# Altium schematic sheet Nixie Valve Clock.SchDoc
size A3; SheetNumber: 1; SheetTotal: 9
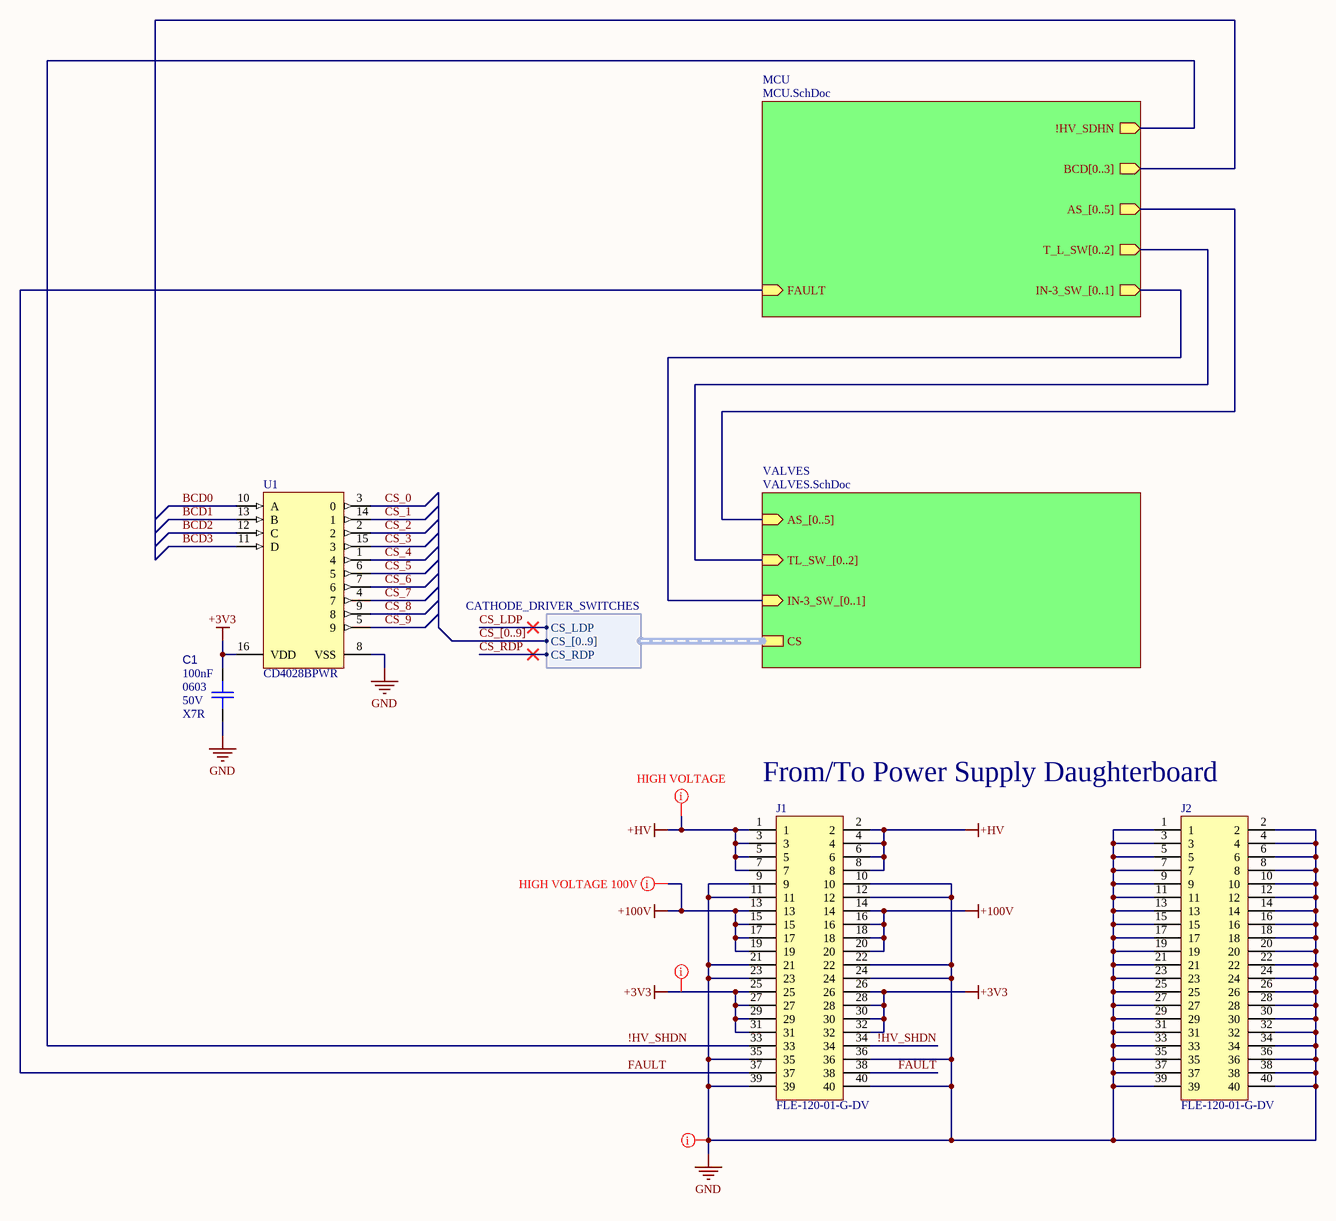
[diagram p0: Nixie Valve Clock.SchDoc]

## Parts
?  (no value)
C1  value 100nF  Voltage Rating: 50V  Case/Package: 0603  Dielectric: X7R  [CAPC1608X09N]  (hidden comment: CGA3E2X7R1H104K080AA)
J1  FLE-120-01-G-DV  [FLE-120-01-XX-DV]
J2  FLE-120-01-G-DV  [FLE-120-01-XX-DV]
U1  CD4028BPWR  [PW0016A_N]

## Sub-sheets
MCU = MCU.SchDoc: AS_[0..5] (out), BCD[0..3] (out), T_L_SW[0..2] (out), IN-3_SW_[0..1] (out), !HV_SDHN (out), FAULT (in)
VALVES = VALVES.SchDoc: AS_[0..5] (in), CS (harness CATHODE_DRIVER_SWITCHES), TL_SW_[0..2] (in), IN-3_SW_[0..1] (in)

## Harnesses
CATHODE_DRIVER_SWITCHES: CS_LDP, CS_[0..9], CS_RDP

## Nets
+3V3: C1.1 J1.25 J1.26 J1.27 J1.28 J1.29 J1.30 J1.31 J1.32 U1.16(VDD)
+100V: J1.13 J1.14 J1.15 J1.16 J1.17 J1.18 J1.19 J1.20
+HV: J1.1 J1.2 J1.3 J1.4 J1.5 J1.6 J1.7 J1.8
GND: C1.2 J1.9 J1.10 J1.11 J1.12 J1.21 J1.22 J1.23 J1.24 J1.35 J1.36 J1.39 J1.40 J2.1 J2.2 J2.3 J2.4 J2.5 J2.6 J2.7 J2.8 J2.9 J2.10 J2.11 J2.12 J2.13 J2.14 J2.15 J2.16 J2.17 J2.18 J2.19 J2.20 J2.21 J2.22 J2.23 J2.24 J2.25 J2.26 J2.27 J2.28 J2.29 J2.30 J2.31 J2.32 J2.33 J2.34 J2.35 J2.36 J2.37 J2.38 J2.39 J2.40 U1.8(VSS)
!HV_SHDN: J1.33 J1.34 ; sheet MCU/!HV_SDHN
BCD0: U1.10(A)
BCD1: U1.13(B)
BCD2: U1.12(C)
BCD3: U1.11(D)
CS_0: U1.3(0)
CS_1: U1.14(1)
CS_2: U1.2
CS_3: U1.15(3)
CS_4: U1.1(4)
CS_5: U1.6(5)
CS_6: U1.7(6)
CS_7: U1.4(7)
CS_8: U1.9(8)
CS_9: U1.5(9)
CS_LDP: sheet VALVES/CS.CS_LDP
CS_RDP: sheet VALVES/CS.CS_RDP
FAULT: J1.37 J1.38 ; sheet MCU/FAULT

## Buses and harness runs
bus CS_[0..9]
bus sheet MCU/AS_[0..5] = sheet VALVES/AS_[0..5]
bus sheet MCU/IN-3_SW_[0..1] = sheet VALVES/IN-3_SW_[0..1]
bus sheet MCU/T_L_SW[0..2] = sheet VALVES/TL_SW_[0..2]

## Layout directives
net class HIGH VOLTAGE: +HV
net class HIGH VOLTAGE 100V: +100V
net class POWER: +3V3, GND

## Notes on the sheet
- From/To Power Supply Daughterboard
- Project:
- Designer:
- Sheet
- of
- Filename:

## Library data of the parts
? = CMP-00003-4: The KETS Schematic Sheet Title Block
C1 = CMP-001-00101-1: Ceramic Capacitor, Multilayer, Ceramic, 50V, 10% +Tol, 10% -Tol, X7R, 15% TC, 0.1uF, Surface Mount, 0603; Reference Standard: AEC-Q200; Multilayer: Yes; Tolerance  (fill in as +-): 10%; Mounting Technology: Surface Mount; Max Operating Temperature: 125°C; Min Operating Temperature: -55°C; Tolerance: 10%; Packaging: Tape and Reel; Length: 1.6mm; Package Style: SMTMeter; Width: 0.8mm; Height: 0.8mm; Pins: 2; Reach SVHC Compliant: Yes; RoHS Compliant: Yes; Package Shape: Rectangular; Tolerance (fill in as +-): 10%; Rated DC Voltage (URdc): 50V; JESD-609 Code: e3; Capacitor Type: Ceramic; Termination: Wraparound; Terminal Finish: Nickel; Dielectric Material: Ceramic; Temperature Characteristics Code: X7R
J1 J2 = CMP-073-000000-3: PCB Receptacle, Board-to-Board, Wire-to-Board, 1.27 mm, 2 Rows, 40 Contacts, Surface Mount; Manufacturer Lifecycle Status: PRODUCTION; Pitch: 1.27mm; MF: Samtec; Connector Type: Receptacle, Socket; Number of Contacts: 40; Max Current Rating: 1.75A; Contact Resistance: 15mΩ; Pins: 40; REACH SVHC: No; Price: None; Component Type: Standard; Pin Count: 40; Housing Color: Black; Lead Pitch: 1.27mm; Number of Rows: 2; Max Operating Temperature: 125°C; MP: FLE-120-01-XX-DV; Value: *; Design Item ID: FLE-120-01-XX-DV; Number of Positions: 40; RoHS: Compliant; Lifecycle Status: Production; Source: FLE-120-01-XX-DV.SchLib; Packaging: Bulk; Orientation: Straight; Contact Material: Bronze; Row Spacing: 1.27mm; Housing Material: Polymer; Current Rating: 1.75A; Contact Plating: Gold; Termination: Solder; Length: 25.51mm; Gender: Receptacle; Lead Free: Lead Free; Depth: 3.33mm; Color: Black; Mounting Technology: Surface Mount; Min Operating Temperature: -55°C; Package: None; Radiation Hardening: No; Availability: Unavailable
U1 = CMP-00024-00008-1: CMOS BCD-to-Decimal or Binary-to-Octal Decoders/Drivers 16-TSSOP -55 to 125; Manufacturer Lifecycle Status: ACTIVE; Min Supply Voltage: 3V; Bandwidth: 8MHz; Number of Outputs: 10; Propagation Delay: 160ns; Logic Function: Decoder, Demultiplexer; Number of Elements: 1; Turn-On Delay Time: 350ns; Polarity: Non-Inverting; Max Supply Voltage: 18V; Number of Inputs: 4; Low Level Output Current: 6.8mA; Quiescent Current: 100µA; Supply Type: Dual, Single; Max Operating Temperature: 125°C; Min Operating Temperature: -55°C; Number of Output Lines: 10; Thickness: 1mm; Weight: 61.887009mg; Independent Circuits: 1; Number of Bits: 10; Number of Channels: 1; RoHS Compliant: Yes; Mounting Technology: Surface Mount; Number of Input Lines: 4; Pins: 16; Width: 4.4mm; Lead Free: Lead Free; Case/Package: TSSOP; RoHS: Compliant; Contact Plating: Gold; High Level Output Current: 6.8mA; Length: 5mm; Lifecycle Status: Production; Height: 1.2mm